# EAGLE design W028A (EAGLE 6.6.0)
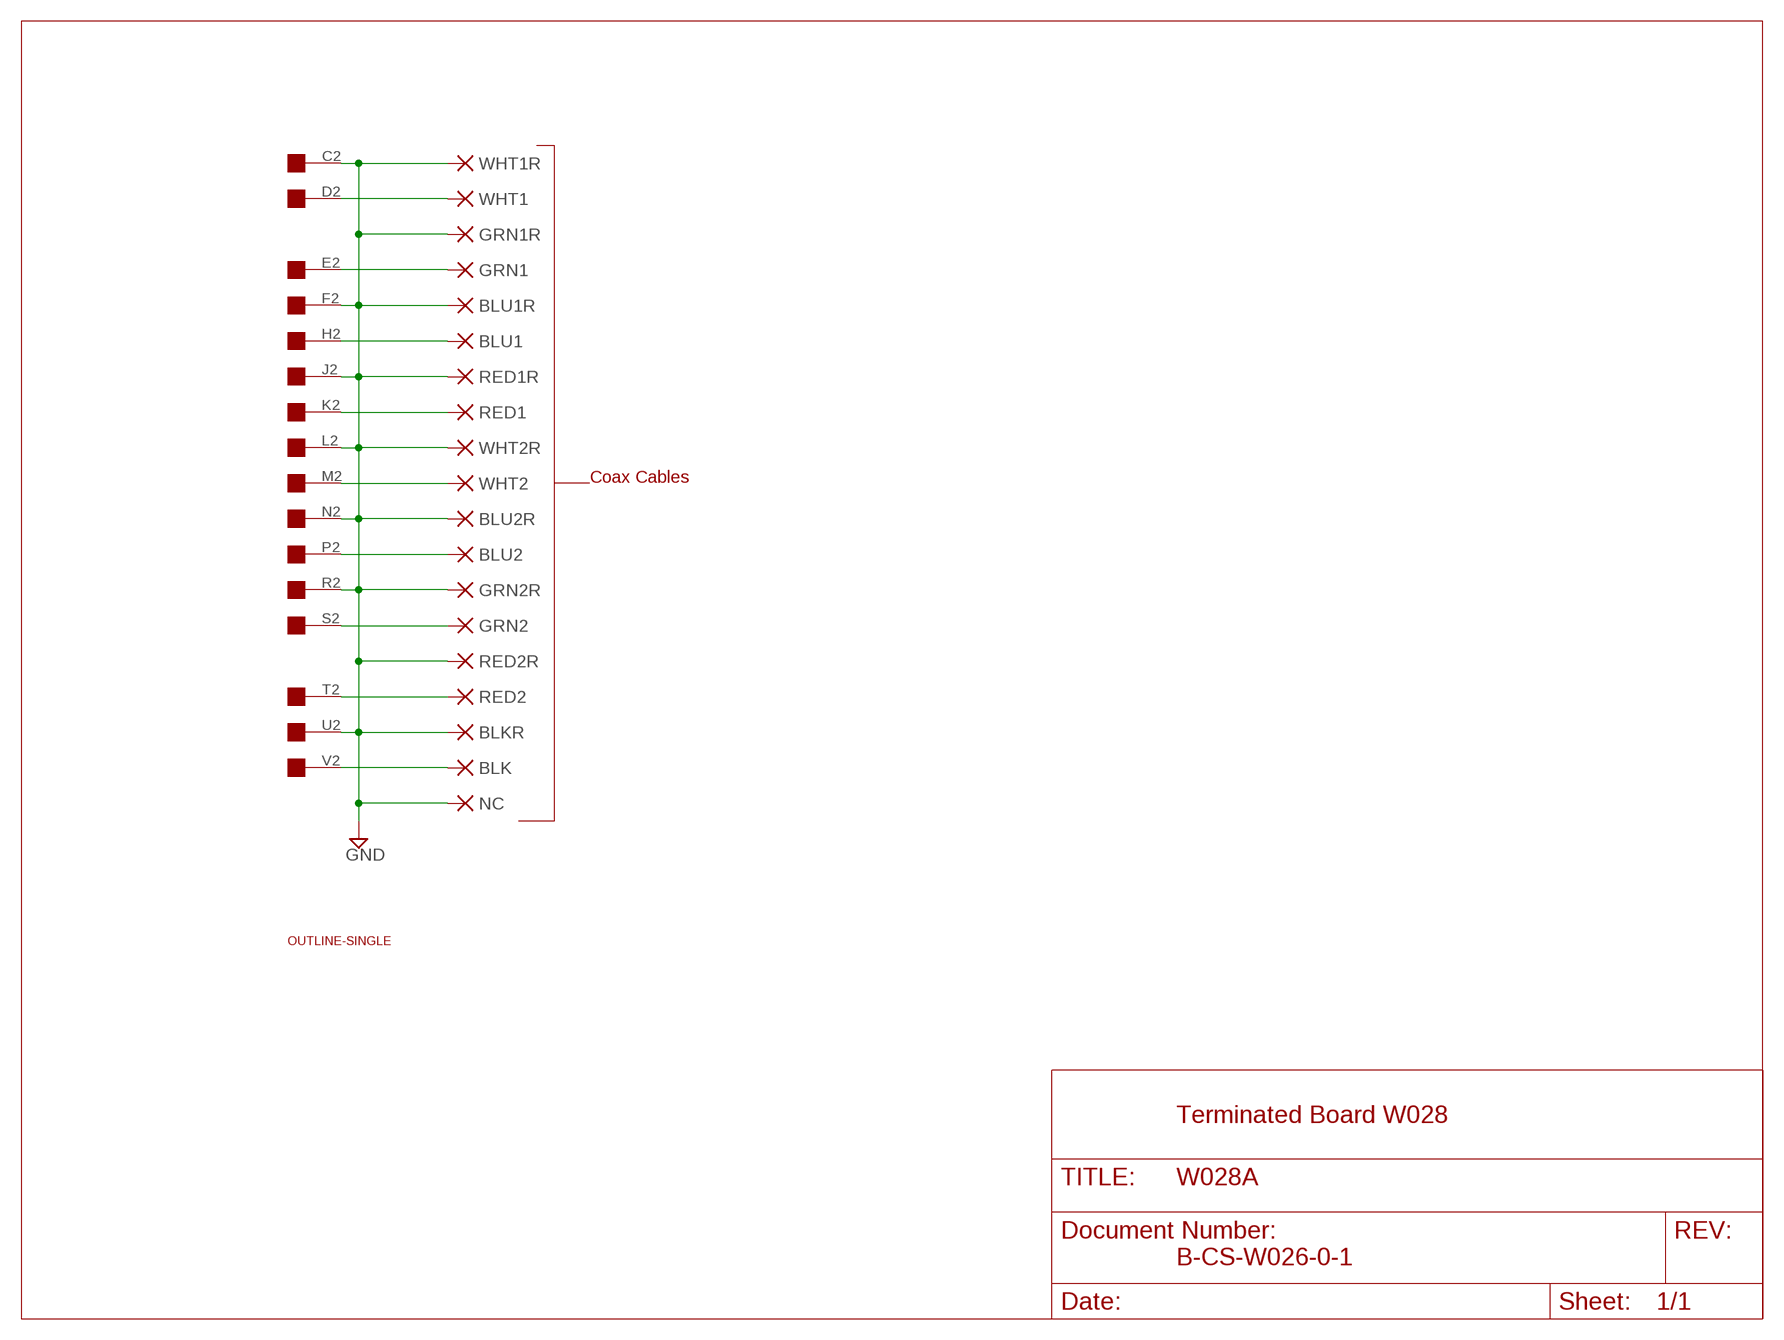
[diagram p0: schematic, sheet 1]

## Parts
BLK  PAD-0465  [0465]
BLKR  PAD-0465  [0465]
BLU1  PAD-0465  [0465]
BLU1R  PAD-0465  [0465]
BLU2  PAD-0465  [0465]
BLU2R  PAD-0465  [0465]
GRN1  PAD-0465  [0465]
GRN1R  PAD-0465  [0465]
GRN2  PAD-0465  [0465]
GRN2R  PAD-0465  [0465]
NC  PAD-0465  [0465]
RED1  PAD-0465  [0465]
RED1R  PAD-0465  [0465]
RED2  PAD-0465  [0465]
RED2R  PAD-0465  [0465]
U$1  OUTLINE-SINGLE  [SINGLE]
U$2  EDGE-1  [EDGE-CON1]
WHT1  PAD-0465  [0465]
WHT1R  PAD-0465  [0465]
WHT2  PAD-0465  [0465]
WHT2R  PAD-0465  [0465]

## Nets
GND [Supply]: BLKR.P$1(P) BLU1R.P$1(P) BLU2R.P$1(P) GRN1R.P$1(P) GRN2R.P$1(P) NC.P$1(P) RED1R.P$1(P) RED2R.P$1(P) U$2.C2 U$2.F2 U$2.J2 U$2.L2 U$2.N2 U$2.R2 U$2.U2 WHT1R.P$1(P) WHT2R.P$1(P)
N$1 [Supply]: GRN1.P$1(P) U$2.E2
N$2 [Supply]: BLU1.P$1(P) U$2.H2
N$3 [Supply]: RED1.P$1(P) U$2.K2
N$4 [Supply]: U$2.M2 WHT2.P$1(P)
N$5 [Supply]: BLU2.P$1(P) U$2.P2
N$6 [Supply]: GRN2.P$1(P) U$2.S2
N$7 [Supply]: RED2.P$1(P) U$2.T2
N$8 [Supply]: BLK.P$1(P) U$2.V2
N$9: U$2.D2 WHT1.P$1(P)
Unconnected: U$2.A2 U$2.B2

## Notes on the sheet
- Coax Cables
- Terminated Board W028
- B-CS-W026-0-1

## Library data of the parts
BLK BLKR BLU1 BLU1R BLU2 BLU2R GRN1 GRN1R GRN2 GRN2R NC RED1 RED1R RED2 RED2R WHT1 WHT1R WHT2 WHT2R = dec-con:PAD: WIRE PAD Standard US Drill Sizes
U$1 = dec-con:OUTLINE-*: Board outlines for DEC boards.
U$2 = dec-con:EDGE-1: Single-Sided DEC Edge Connector -- (side 2)

## Net classes
1 Supply: width 0.813 mm

## Board
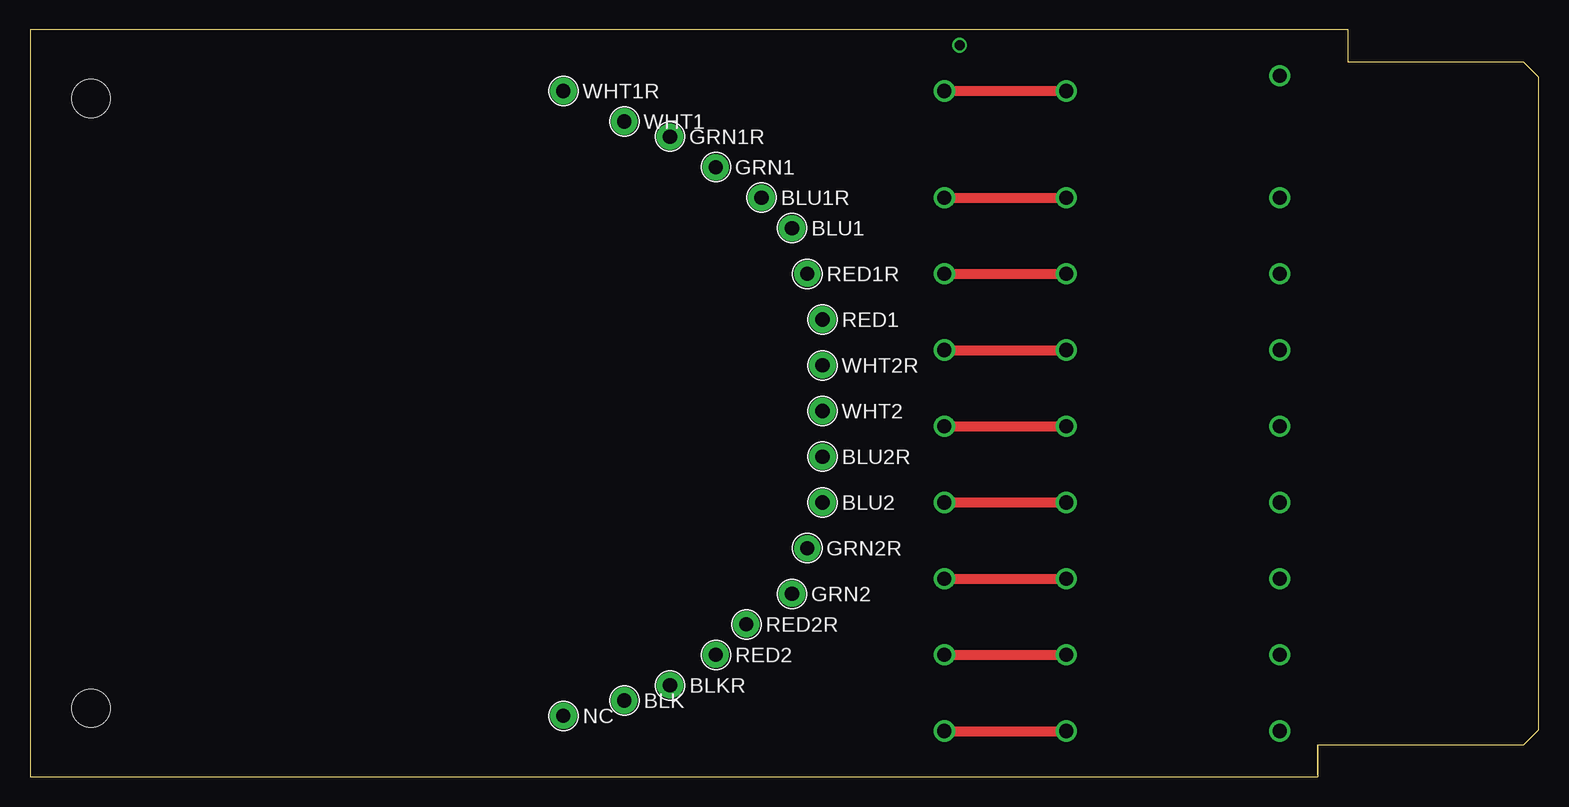
[diagram p1: board, top side]
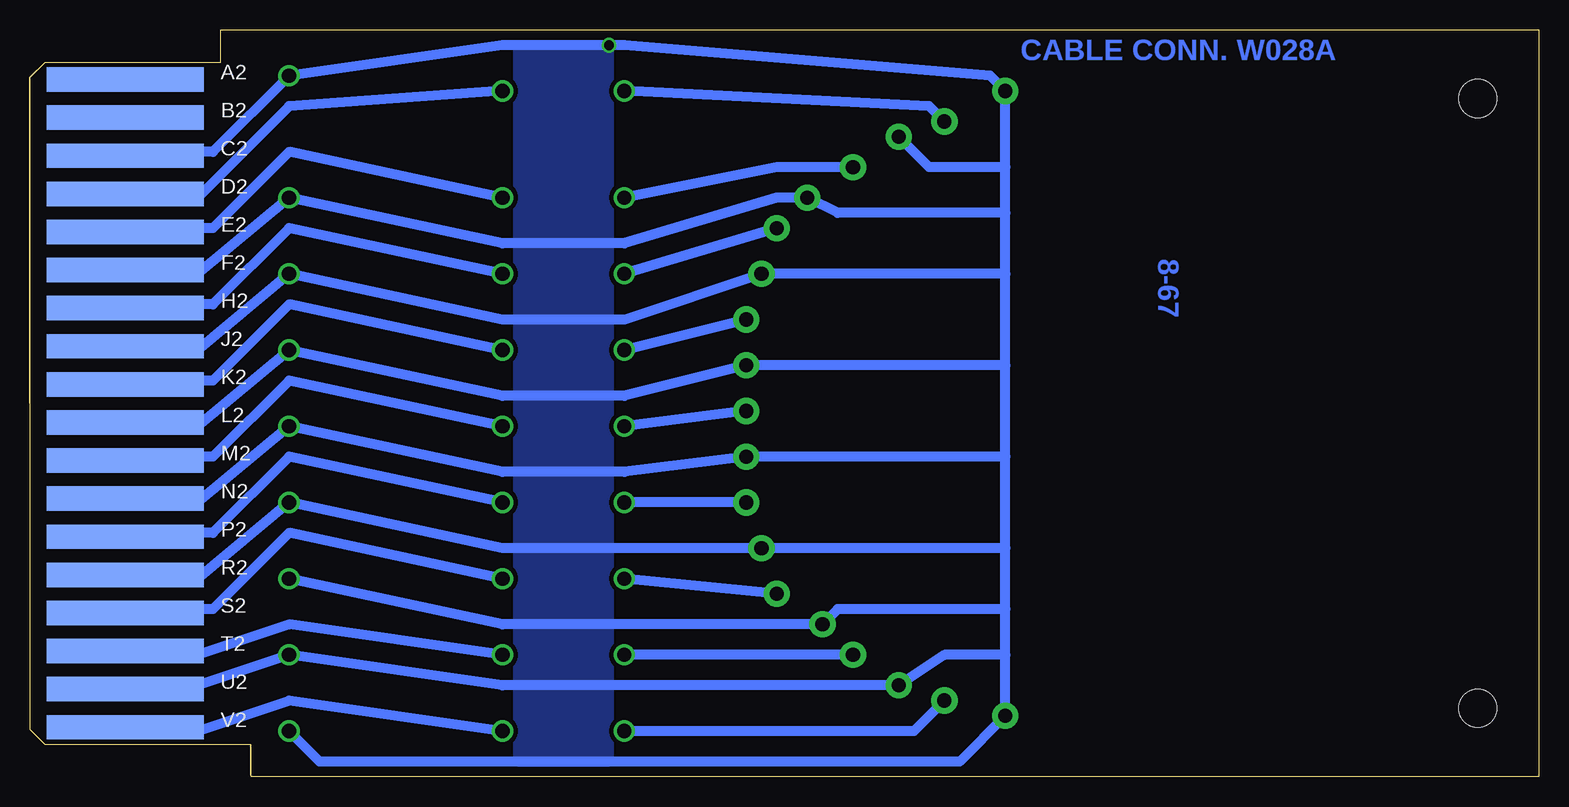
[diagram p2: board, bottom side, seen from below]

Size 125.73 x 62.23 mm. Coordinates in mm from the lower left corner, seen from the top.
Copper layers (1+16): Top 0.035mm / dielectric 1.5mm / Bottom 0.035mm
Design rules "16mils": minimum track width 16mil, minimum drill 32mil, track to track 15mil, track to pad 10mil, pad to pad 10mil, via to via 10mil, smd to smd 10mil, copper to edge 13mil, drill to drill 10mil, minimum pad ring 10mil, minimum via ring 8mil, stop-mask expansion 0mil, vias tented up to drill 0mil, thermal gap 10mil

### Footprints (pad centres in the part's own frame; a part is rotated, then mirrored left to right if it is on the bottom)
0465 = drill 1.181 pad 2.184: P$1 0,0
SINGLE = hole 3.175: 120.65,56.515; 120.65,5.715
EDGE-CON1 = smd 13.106 x 2.032 bottom: A2 7.938,4.128; B2 7.938,7.303; C2 7.938,10.477; D2 7.938,13.652; E2 7.938,16.828; F2 7.938,20.003; H2 7.938,23.177; J2 7.938,26.352; K2 7.938,29.527; L2 7.938,32.703; M2 7.938,35.877; N2 7.938,39.053; P2 7.938,42.227; R2 7.938,45.403; S2 7.938,48.578; T2 7.938,51.752; U2 7.938,54.928; V2 7.938,58.102

### Placement (x,y rotation side)
BLK  49.53,6.35 0 top
BLKR  53.34,7.62 0 top
BLU1  63.5,45.72 0 top
BLU1R  60.96,48.26 0 top
BLU2  66.04,22.86 0 top
BLU2R  66.04,26.67 0 top
GRN1  57.15,50.8 0 top
GRN1R  53.34,53.34 0 top
GRN2  63.5,15.24 0 top
GRN2R  64.77,19.05 0 top
NC  44.45,5.08 0 top
RED1  66.04,38.1 0 top
RED1R  64.77,41.91 0 top
RED2  57.15,10.16 0 top
RED2R  59.69,12.7 0 top
U$1  125.73,62.23 180 top
U$2  125.73,62.23 180 top
WHT1  49.53,54.61 0 top
WHT1R  44.45,57.15 0 top
WHT2  66.04,30.48 0 top
WHT2R  66.04,34.29 0 top

### Tracks (layer width: path | path; a pad name or v marks a point on that pad's centre or on a via)
GND  (via drill 0.81, 1.18)
  Bottom 0.813: 44.45,10.16 NC.P$1 48.26,1.27 101.6,1.27 v104.14,3.81 | 44.45,10.16 44.45,13.97 | 44.45,13.97 44.45,19.05 | 44.45,19.05 44.45,26.67 | 44.45,26.67 44.45,34.29 | 44.45,34.29 44.45,41.91 | 44.45,41.91 44.45,46.99 | 44.45,46.99 44.45,50.8 | 44.45,50.8 WHT1R.P$1 45.72,58.42 76.2,60.96 v77.47,60.96 86.36,60.96 v104.14,58.42 110.49,52.07 116.84,52.07 U$2.C2 | U$2.L2 116.84,29.21 111.76,29.21 v104.14,35.56 86.36,31.75 76.2,31.75 WHT2R.P$1 44.45,34.29 | U$2.N2 116.84,22.86 111.76,22.86 v104.14,29.21 86.36,25.4 76.2,25.4 BLU2R.P$1 44.45,26.67 | U$2.U2 116.84,7.62 111.76,7.62 v104.14,10.16 86.36,7.62 BLKR.P$1 49.53,10.16 44.45,10.16 | 44.45,13.97 58.42,13.97 RED2R.P$1 86.36,12.7 v104.14,16.51 | 44.45,19.05 GRN2R.P$1 86.36,19.05 v104.14,22.86 111.76,16.51 116.84,16.51 U$2.R2 | 44.45,41.91 RED1R.P$1 76.2,38.1 86.36,38.1 v104.14,41.91 111.76,35.56 116.84,35.56 U$2.J2 | 44.45,46.99 58.42,46.99 BLU1R.P$1 63.5,48.26 76.2,44.45 86.36,44.45 v104.14,48.26 111.76,41.91 116.84,41.91 U$2.F2 | GRN1R.P$1 50.8,50.8 44.45,50.8
  pour Bottom: 77.47,60.96 85.09,60.96 85.09,1.27 77.47,1.27
N$1  (via drill 1.18)
  Top 0.813: v76.2,48.26 v86.36,48.26
  Bottom 0.813: U$2.E2 116.84,45.72 111.76,45.72 110.49,45.72 104.14,52.07 v86.36,48.26 | GRN1.P$1 63.5,50.8 v76.2,48.26
N$2  (via drill 1.18)
  Top 0.813: v76.2,41.91 v86.36,41.91
  Bottom 0.813: U$2.H2 116.84,39.37 111.76,39.37 110.49,39.37 104.14,45.72 v86.36,41.91 | BLU1.P$1 v76.2,41.91
N$3  (via drill 1.18)
  Top 0.813: v76.2,35.56 v86.36,35.56
  Bottom 0.813: U$2.K2 116.84,33.02 111.76,33.02 110.49,33.02 104.14,39.37 v86.36,35.56 | RED1.P$1 v76.2,35.56
N$4  (via drill 1.18)
  Top 0.813: v76.2,29.21 v86.36,29.21
  Bottom 0.813: U$2.M2 116.84,26.67 111.76,26.67 110.49,26.67 104.14,33.02 v86.36,29.21 | WHT2.P$1 v76.2,29.21
N$5  (via drill 1.18)
  Top 0.813: v76.2,22.86 v86.36,22.86
  Bottom 0.813: U$2.P2 117.17,19.99 116.84,20.32 111.76,20.32 110.49,20.32 104.14,26.67 v86.36,22.86 | BLU2.P$1 v76.2,22.86
N$6  (via drill 1.18)
  Top 0.813: v76.2,16.51 v86.36,16.51
  Bottom 0.813: U$2.S2 116.84,13.97 111.76,13.97 110.49,13.97 104.14,20.32 v86.36,16.51 | GRN2.P$1 v76.2,16.51
N$7  (via drill 1.18)
  Top 0.813: v76.2,10.16 v86.36,10.16
  Bottom 0.813: U$2.T2 116.84,10.16 111.76,10.16 104.14,12.7 v86.36,10.16 | RED2.P$1 v76.2,10.16
N$8  (via drill 1.18)
  Top 0.813: v76.2,3.81 v86.36,3.81
  Bottom 0.813: U$2.V2 116.84,3.81 111.76,3.81 104.14,6.35 v86.36,3.81 | v76.2,3.81 52.07,3.81 BLK.P$1
N$9  (via drill 1.18)
  Top 0.813: v76.2,57.15 v86.36,57.15
  Bottom 0.813: U$2.D2 116.84,48.26 111.76,48.26 104.14,55.88 v86.36,57.15 | v76.2,57.15 50.8,55.88 WHT1.P$1

### Text on the board
Bottom: CABLE CONN. W028A | 8-67
200bmp: C:/Users/Vince/Documents/websvn/trunk/Eagle/projects/DEC/Wxxx/W021/W021Abackfb.bmp